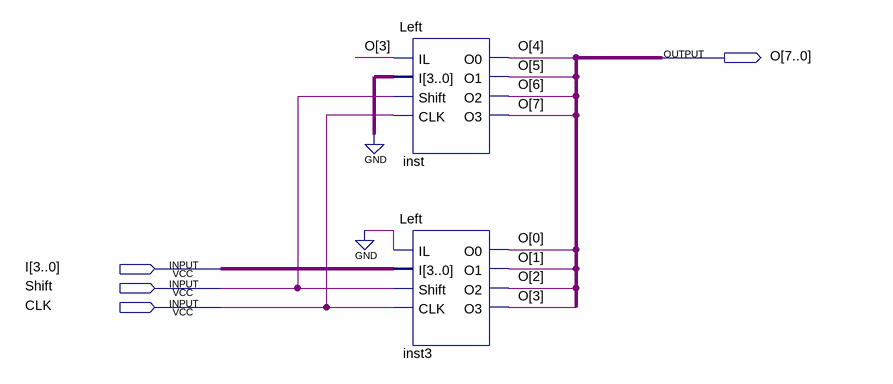
[diagram p0: schematic sheet]
// Quartus schematic 8sl.bdf as structural Verilog: 2 symbols, 4 pins
module \8sl  (
  input  [3:0] I,
  input  Shift,
  input  CLK,
  output [7:0] O
);

  Left inst (.IL(O[3]), .I(4'b0000), .Shift(Shift), .CLK(CLK), .O0(O[4]), .O1(O[5]), .O2(O[6]), .O3(O[7]));
  Left inst3 (.IL(1'b0), .I(I), .Shift(Shift), .CLK(CLK), .O0(O[0]), .O1(O[1]), .O2(O[2]), .O3(O[3]));
endmodule
